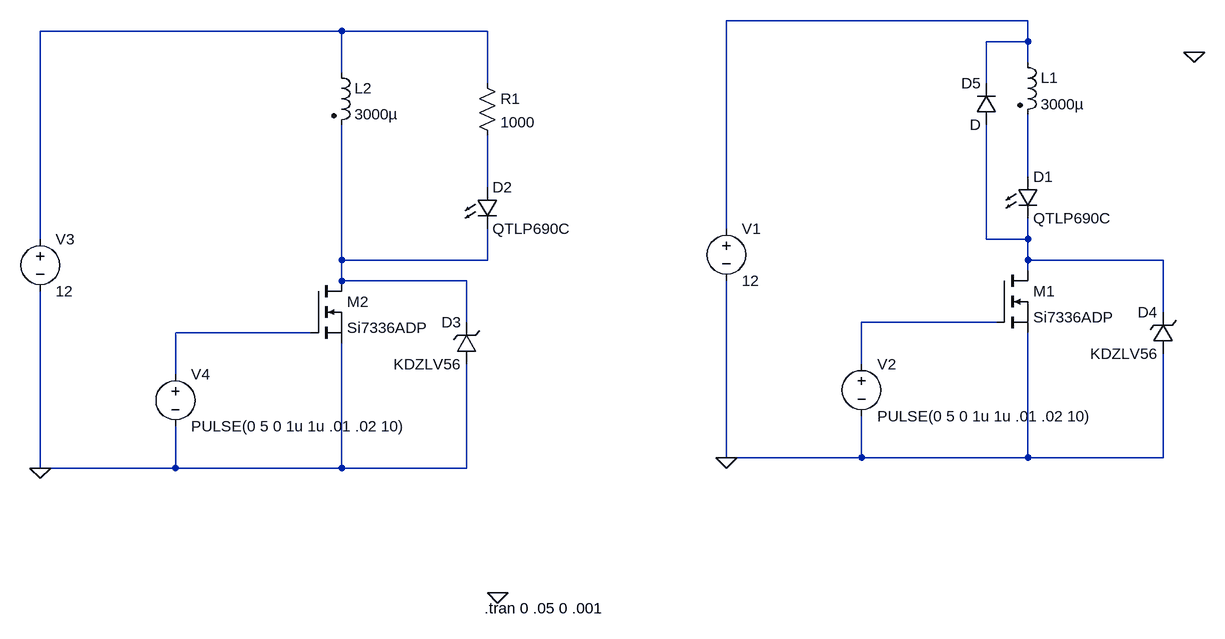
[diagram p0: schematic Relay_Coil_Kickback.asc]
Relay_Coil_Kickback.asc, the LTspice schematic file:
Version 4
SHEET 1 880 680
WIRE 416 -352 -48 -352
WIRE -640 -336 -1104 -336
WIRE -416 -336 -640 -336
WIRE 416 -320 416 -352
WIRE 416 -320 352 -320
WIRE 416 -288 416 -320
WIRE -640 -272 -640 -336
WIRE -416 -256 -416 -336
WIRE 352 -256 352 -320
WIRE 416 -112 416 -208
WIRE -416 -96 -416 -176
WIRE -48 -32 -48 -352
WIRE -1104 -16 -1104 -336
WIRE 352 -16 352 -192
WIRE 416 -16 416 -48
WIRE 416 -16 352 -16
WIRE -640 16 -640 -192
WIRE -416 16 -416 -32
WIRE -416 16 -640 16
WIRE 416 16 416 -16
WIRE 624 16 416 16
WIRE 416 32 416 16
WIRE -640 48 -640 16
WIRE -448 48 -640 48
WIRE 624 96 624 16
WIRE -448 112 -448 48
WIRE 368 112 160 112
WIRE -688 128 -896 128
WIRE 160 176 160 112
WIRE -896 192 -896 128
WIRE -48 320 -48 48
WIRE 160 320 160 256
WIRE 160 320 -48 320
WIRE 416 320 416 128
WIRE 416 320 160 320
WIRE 624 320 624 160
WIRE 624 320 416 320
WIRE -1104 336 -1104 64
WIRE -896 336 -896 272
WIRE -896 336 -1104 336
WIRE -640 336 -640 144
WIRE -640 336 -896 336
WIRE -448 336 -448 176
WIRE -448 336 -640 336
FLAG -400 528 0
FLAG 672 -304 0
FLAG -48 320 0
FLAG -1104 336 0
SYMBOL ind2 400 -304 R0
SYMATTR InstName L1
SYMATTR Value 3000µ
SYMATTR Type ind
SYMATTR SpiceLine Rser=1029
SYMBOL voltage -48 -48 R0
WINDOW 123 0 0 Left 0
WINDOW 39 0 0 Left 0
SYMATTR InstName V1
SYMATTR Value 12
SYMBOL voltage 160 160 R0
WINDOW 123 0 0 Left 0
WINDOW 39 0 0 Left 0
SYMATTR InstName V2
SYMATTR Value PULSE(0 5 0 1u 1u .01 .02 10)
SYMBOL nmos 368 32 R0
SYMATTR InstName M1
SYMATTR Value Si7336ADP
SYMBOL LED 400 -112 R0
SYMATTR InstName D1
SYMATTR Value QTLP690C
SYMATTR Description Diode
SYMATTR Type diode
SYMBOL ind2 -656 -288 R0
SYMATTR InstName L2
SYMATTR Value 3000µ
SYMATTR Type ind
SYMATTR SpiceLine Rser=1029
SYMBOL voltage -1104 -32 R0
WINDOW 123 0 0 Left 0
WINDOW 39 0 0 Left 0
SYMATTR InstName V3
SYMATTR Value 12
SYMBOL voltage -896 176 R0
WINDOW 123 0 0 Left 0
WINDOW 39 0 0 Left 0
SYMATTR InstName V4
SYMATTR Value PULSE(0 5 0 1u 1u .01 .02 10)
SYMBOL nmos -688 48 R0
SYMATTR InstName M2
SYMATTR Value Si7336ADP
SYMBOL LED -432 -96 R0
SYMATTR InstName D2
SYMATTR Value QTLP690C
SYMATTR Description Diode
SYMATTR Type diode
SYMBOL res -432 -272 R0
SYMATTR InstName R1
SYMATTR Value 1000
SYMBOL zener -432 176 R180
WINDOW 0 24 64 Left 2
WINDOW 3 24 0 Left 2
SYMATTR InstName D3
SYMATTR Value KDZLV56
SYMATTR Description Diode
SYMATTR Type diode
SYMBOL zener 640 160 R180
WINDOW 0 24 64 Left 2
WINDOW 3 24 0 Left 2
SYMATTR InstName D4
SYMATTR Value KDZLV56
SYMATTR Description Diode
SYMATTR Type diode
SYMBOL diode 368 -192 R180
WINDOW 0 24 64 Left 2
WINDOW 3 24 0 Left 2
SYMATTR InstName D5
TEXT -420 552 Left 2 !.tran 0 .05 0 .001

The netlist it stands for:
* Relay_Coil_Kickback.asc
L1 N001 N003 3000µ Rser=1029
V1 N001 0 12
V2 N007 0 PULSE(0 5 0 1u 1u .01 .02 10)
M1 N005 N007 0 0 Si7336ADP
D1 N003 N005 QTLP690C
L2 N002 N006 3000µ Rser=1029
V3 N002 0 12
V4 N008 0 PULSE(0 5 0 1u 1u .01 .02 10)
M2 N006 N008 0 0 Si7336ADP
D2 N004 N006 QTLP690C
R1 N002 N004 1000
D3 0 N006 KDZLV56
D4 0 N005 KDZLV56
D5 N005 N001 D
.model D D
.lib standard.dio
.model NMOS NMOS
.model PMOS PMOS
.lib standard.mos
.tran 0 .05 0 .001
.backanno
.end